# EAGLE design VA-Meter_Analog_Part (EAGLE 7.1.0)
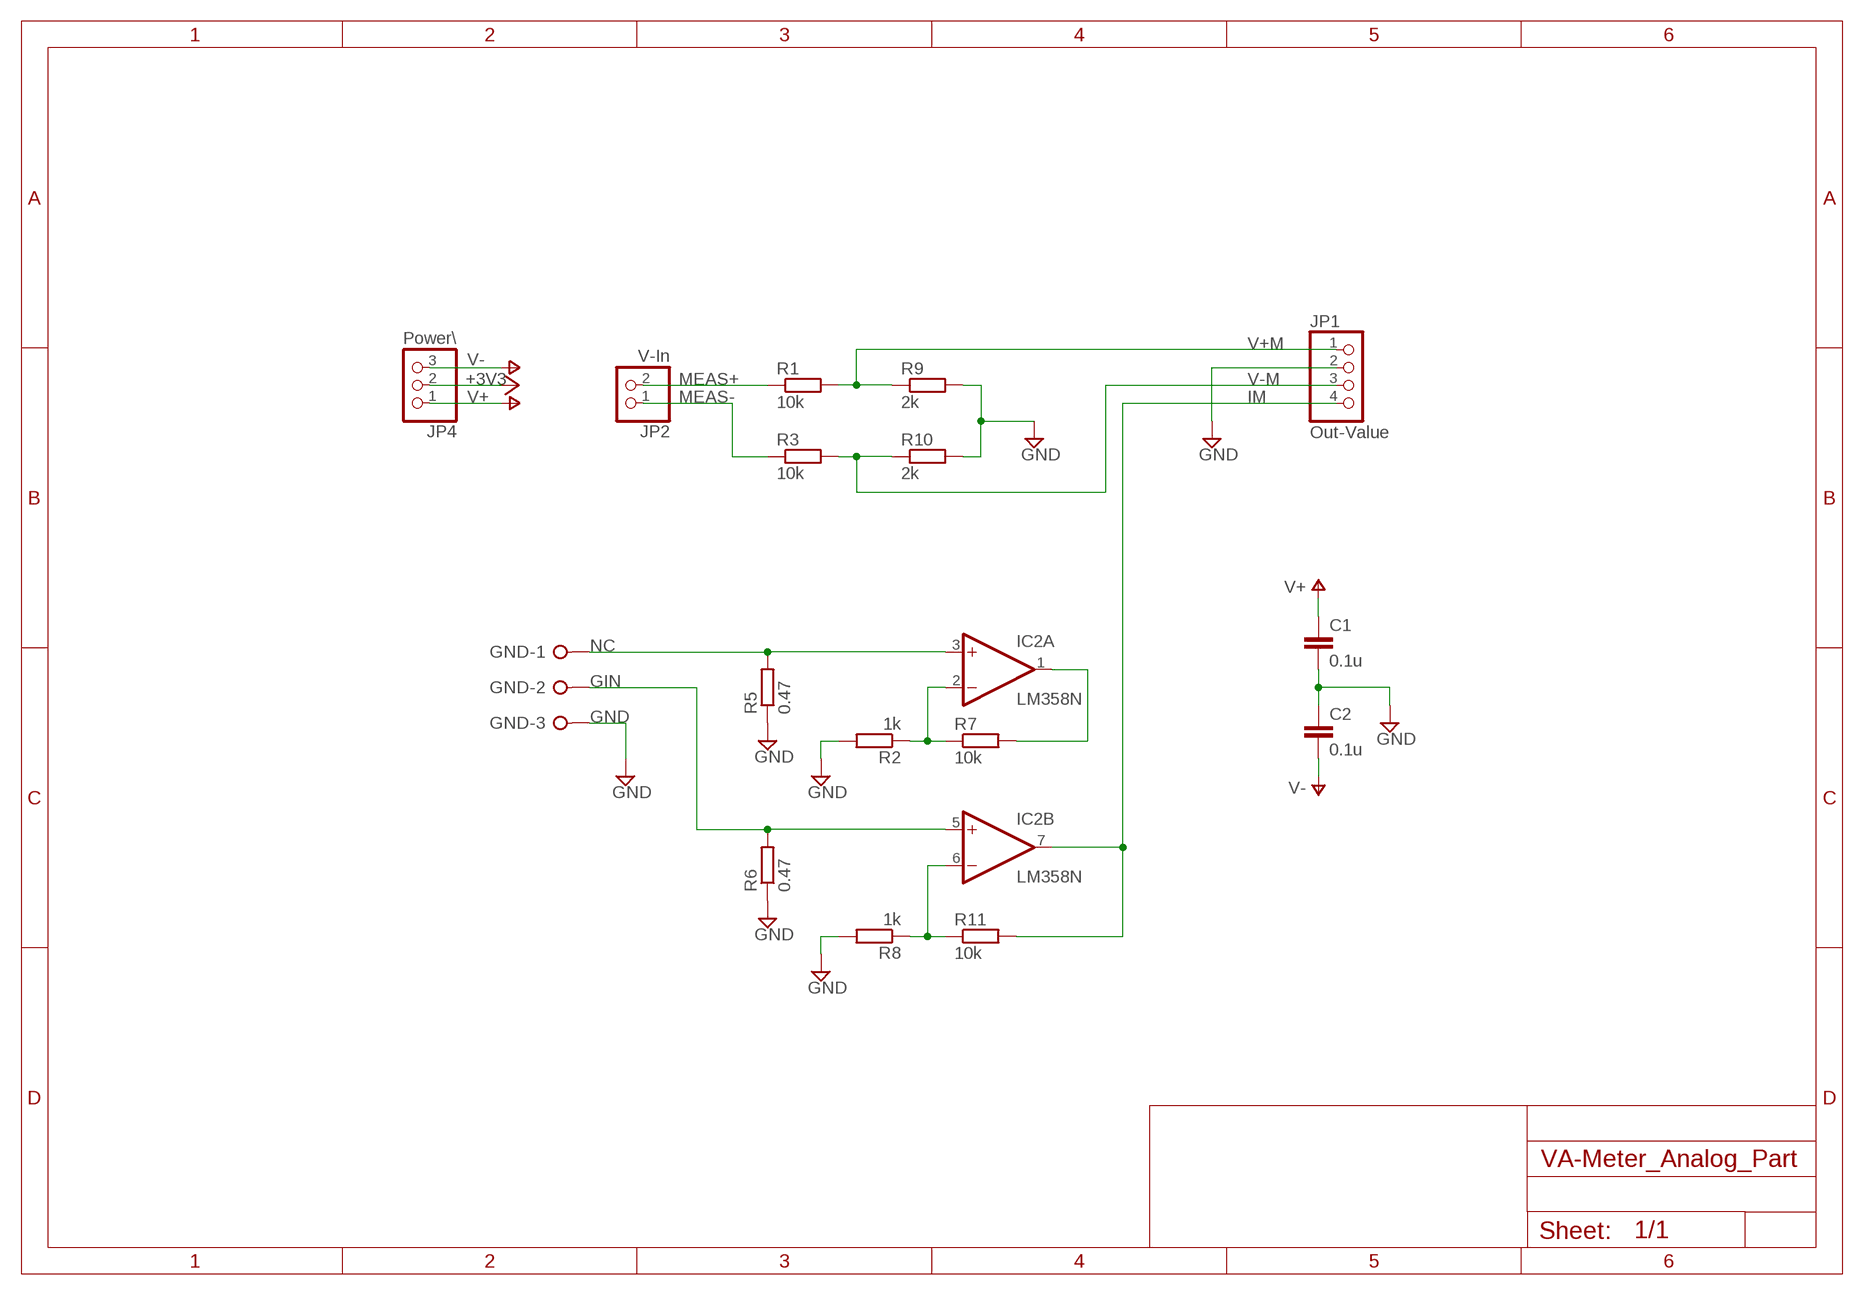
[diagram p0: schematic, sheet 1]

## Parts
C1  0.1u  C-EU050-024X044  [C050-024X044]
C2  0.1u  C-EU050-024X044  [C050-024X044]
GND  W237-03P  [W237-133]
IC2  LM358N  [DIL08]
JP1  Out-Value  PINHD-1X4  [1X04]
JP2  V-In  PINHD-1X2  [1X02]
JP4  Power\  PINHD-1X3  [1X03]
R1  10k  R-EU_0207/7  [0207/7]
R2  1k  R-EU_0207/7  [0207/7]
R3  10k  R-EU_0207/7  [0207/7]
R5  0.47  R-EU_0613/15  [P0613/15]
R6  0.47  R-EU_0613/15  [P0613/15]
R7  10k  R-EU_0207/7  [0207/7]
R8  1k  R-EU_0207/7  [0207/7]
R9  2k  R-EU_0207/7  [0207/7]
R10  2k  R-EU_0207/7  [0207/7]
R11  10k  R-EU_0207/7  [0207/7]

## Nets
+3V3: JP4.2
GIN: GND.2 IC2.5(B:+IN) R6.2
GND: C1.2 C2.1 GND.3 JP1.2 R2.2 R5.1 R6.1 R8.2 R9.2 R10.2
IM: IC2.7(B:OUT) JP1.4 R11.2
MEAS+: JP2.2 R1.1
MEAS-: JP2.1 R3.1
N$1: IC2.1(A:OUT) R7.2
N$6: IC2.2(A:-IN) R2.1 R7.1
N$8: IC2.6(B:-IN) R8.1 R11.1
NC: GND.1 IC2.3(A:+IN) R5.2
V+: C1.1 JP4.1
V+M: JP1.1 R1.2 R9.1
V-: C2.2 JP4.3
V-M: JP1.3 R3.2 R10.1

## Power pins joined to a net without a drawn wire
V+: IC2.8(P:V+)
V-: IC2.4(P:V-)

## Library data of the parts
C1 C2 = rcl:C-EU: CAPACITOR, European symbol
GND = con-wago-508:W237-03P: WAGO SREW CLAMP; OC_FARNELL: unknown; OC_NEWARK: unknown
IC2 = linear:LM358: OP AMP also LM158; LM258; LM2904 Source: http://cache.national.com/ds/LM/LM158.pdf
JP1 = pinhead:PINHD-1X4: PIN HEADER
JP2 = pinhead:PINHD-1X2: PIN HEADER
JP4 = pinhead:PINHD-1X3: PIN HEADER
R1-R3 R5-R11 = rcl:R-EU_: RESISTOR, European symbol

## Board
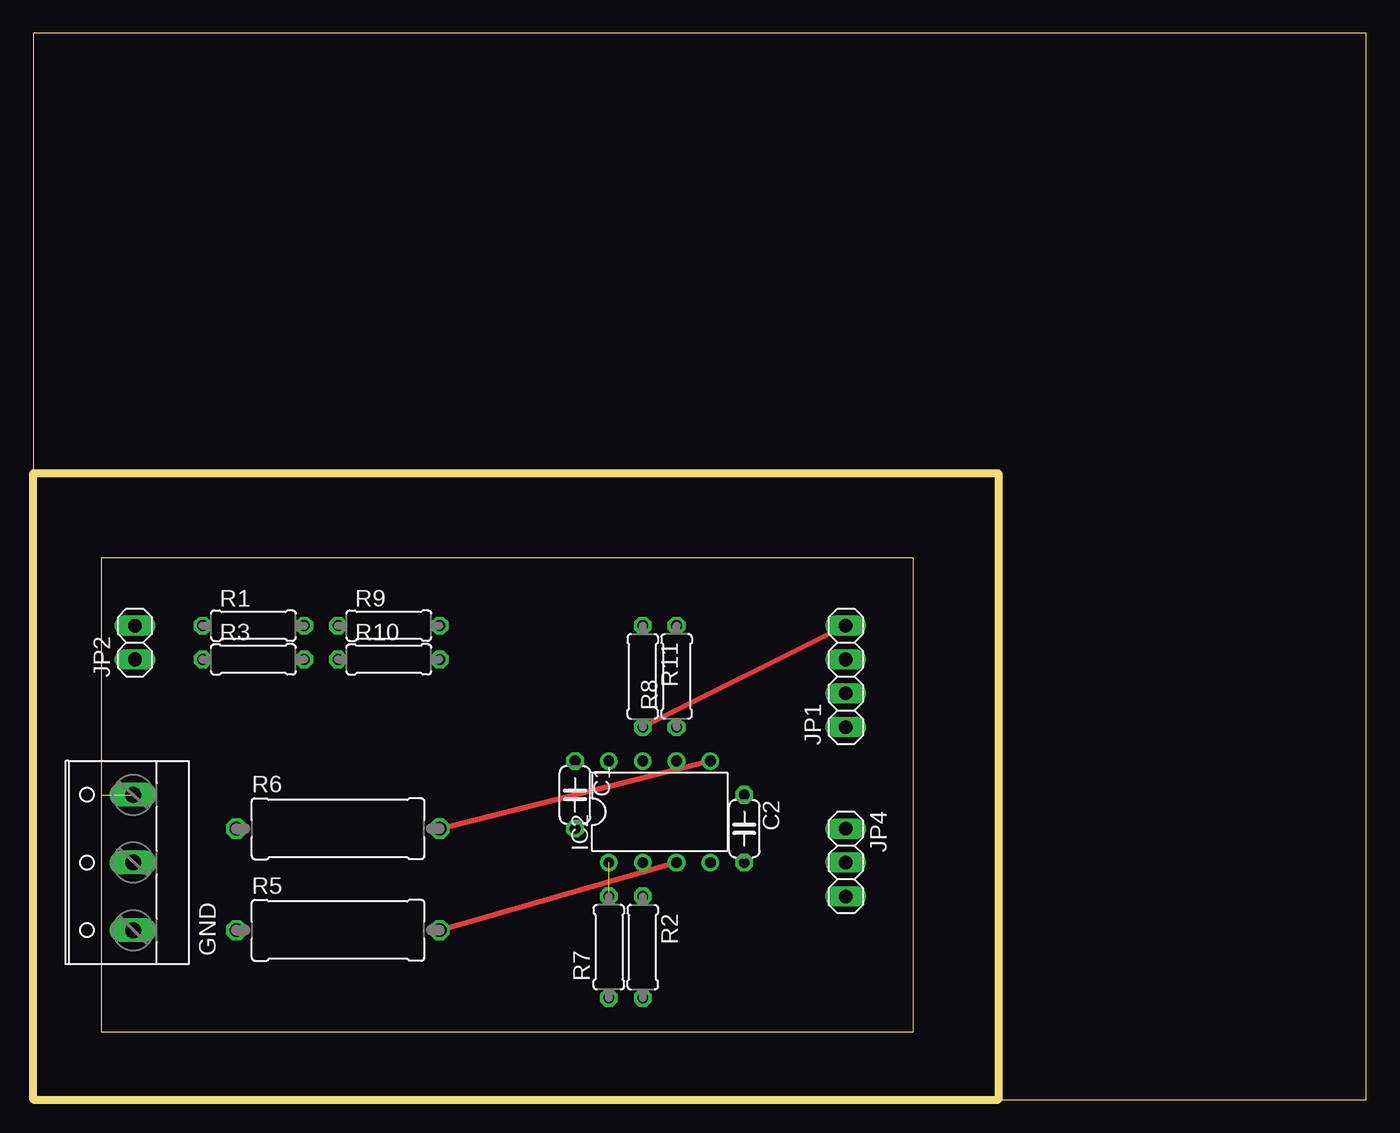
[diagram p1: board, top side]
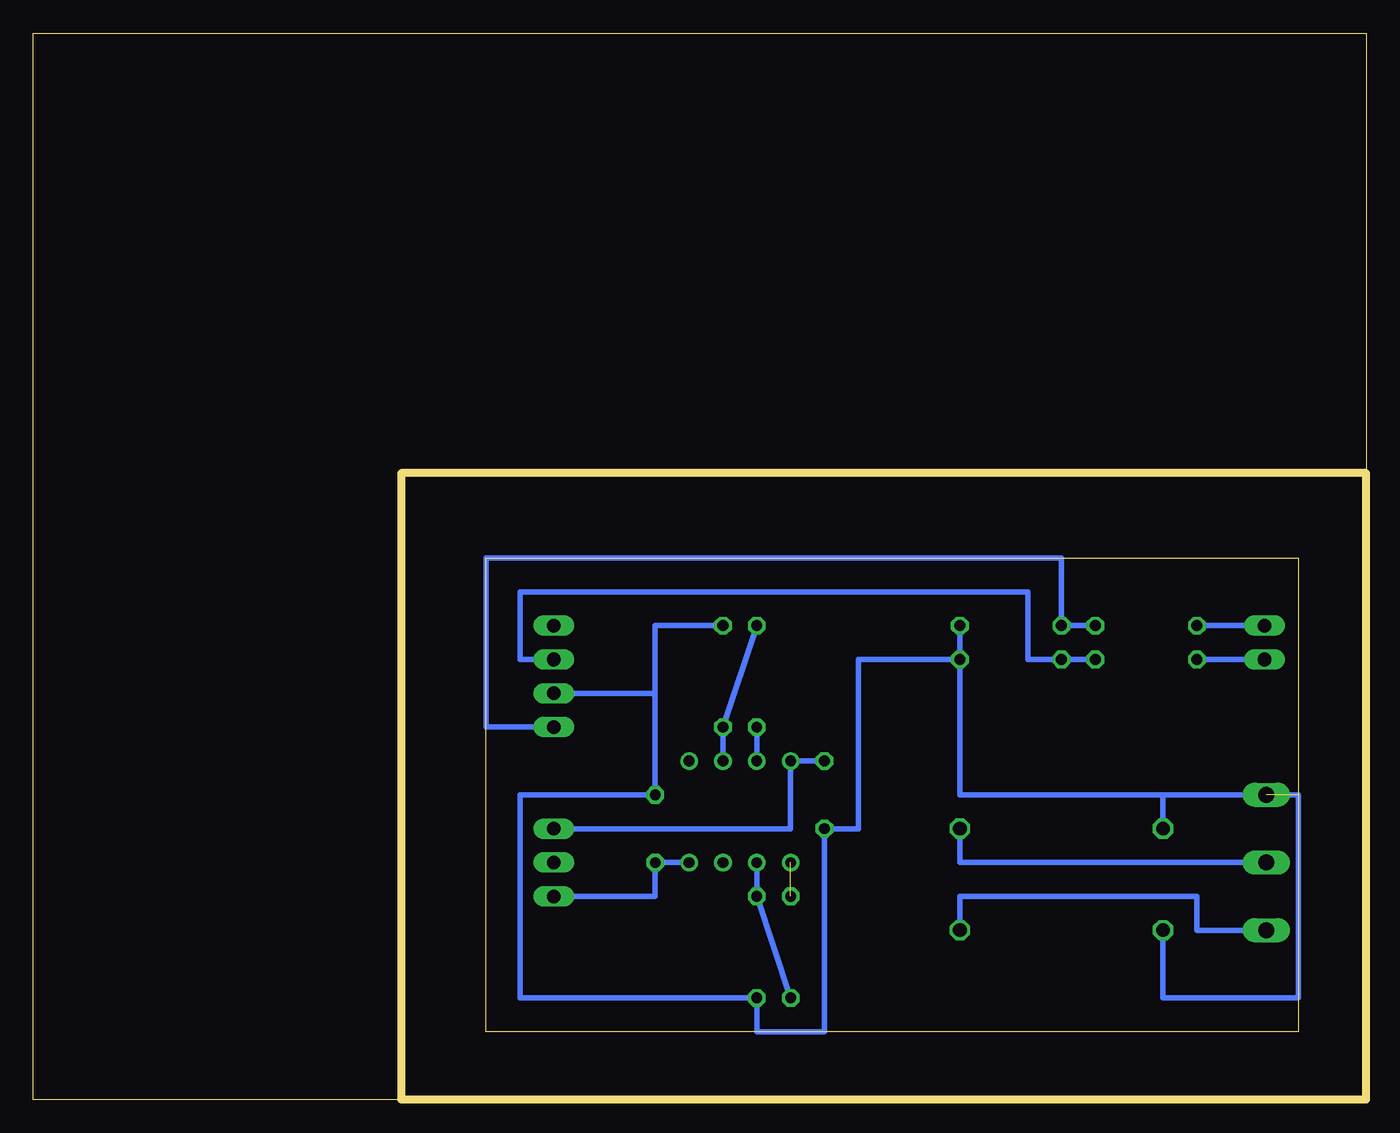
[diagram p2: board, bottom side, seen from below]

Size 100 x 80 mm. Coordinates in mm from the lower left corner, seen from the top.
Outline: 0,0 100,0 100,80 0,80 0,0
Outline: 0,0 0,46.99 72.39,46.99 72.39,0 0,0
Outline: 5.08,5.08 66.04,5.08 66.04,40.64 5.08,40.64 5.08,5.08
Copper layers (1*16): Top 0.035mm / dielectric 1.5mm / Bottom 0.035mm
Design rules "default": minimum track width 10mil, minimum drill 24mil, track to track 8mil, track to pad 8mil, pad to pad 8mil, via to via 8mil, smd to smd 8mil, copper to edge 40mil, drill to drill 8mil, minimum pad ring 10mil, minimum via ring 8mil, stop-mask expansion 4mil, vias tented up to drill 0mil, thermal gap 10mil

### Footprints (pad centres in the part's own frame; a part is rotated, then mirrored left to right if it is on the bottom)
C050-024X044 = drill 0.813 octagon: 1 -2.54,0; 2 2.54,0
W237-133 = drill 1.194 long: 1 -5.08,-0.635; 2 0,-0.635; 3 5.08,-0.635
DIL08 = drill 0.813 pad 1.27: 1 -3.81,-3.81; 2 -1.27,-3.81; 3 1.27,-3.81; 4 3.81,-3.81; 5 3.81,3.81; 6 1.27,3.81; 7 -1.27,3.81; 8 -3.81,3.81
1X04 = drill 1.016 long: 1 -3.81,0; 2 -1.27,0; 3 1.27,0; 4 3.81,0
1X02 = drill 1.016 long: 1 -1.27,0; 2 1.27,0
1X03 = drill 1.016 long: 1 -2.54,0; 2 0,0; 3 2.54,0
0207/7 = drill 0.813 octagon: 1 -3.81,0; 2 3.81,0
P0613/15 = drill 1.016 octagon: 1 -7.62,0; 2 7.62,0

### Placement (x,y rotation side)
C1  40.64,22.86 270 top
C2  53.34,20.32 270 top
GND  6.86,17.78 90 top
IC2  46.99,21.59 0 top
JP1  60.96,31.75 90 top
JP2  7.62,34.29 90 top
JP4  60.96,17.78 270 top
R1  16.51,35.56 0 top
R2  45.72,11.43 270 top
R3  16.51,33.02 0 top
R5  22.86,12.7 0 top
R6  22.86,20.32 0 top
R7  43.18,11.43 90 top
R8  48.26,31.75 90 top
R9  26.67,35.56 0 top
R10  26.67,33.02 0 top
R11  45.72,31.75 270 top

### Tracks (layer width: path | path; a pad name or v marks a point on that pad's centre or on a via)
GIN
  Top 0.406: R6.2 IC2.5
  Bottom 0.406: GND.2 30.48,17.78 R6.2
GND  (1 unrouted)
  Bottom 0.406: R8.2 53.34,35.56 53.34,30.48 | 53.34,30.48 C2.1 63.5,22.86 63.5,7.62 R2.2 45.72,5.08 40.64,5.08 C1.2 38.1,20.32 38.1,33.02 R10.2 | R9.2 R10.2 | R6.1 15.24,22.86 | 15.24,22.86 5.08,22.86 5.08,7.62 15.24,7.62 R5.1 | R10.2 30.48,22.86 15.24,22.86 | JP1.2 53.34,30.48
IM
  Top 0.406: R11.2 JP1.4
  Bottom 0.406: IC2.7 R11.2
MEAS+
  Bottom 0.406: JP2.2 R1.1
MEAS-
  Bottom 0.406: JP2.1 R3.1
N$1  (1 unrouted)
N$6
  Bottom 0.406: IC2.2 R2.1 R7.1
N$8
  Bottom 0.406: IC2.6 R8.1 R11.1
NC
  Top 0.406: IC2.3 R5.2
  Bottom 0.406: GND.1 12.7,12.7 12.7,15.24 30.48,15.24 R5.2
V+
  Bottom 0.406: C1.1 IC2.8 43.18,20.32 JP4.1
V+M
  Bottom 0.406: R1.2 R9.1 22.86,40.64 66.04,40.64 66.04,27.94 JP1.1
V-
  Bottom 0.406: IC2.4 C2.2 53.34,15.24 JP4.3
V-M
  Bottom 0.406: R3.2 R10.1 25.4,33.02 25.4,38.1 63.5,38.1 63.5,33.02 JP1.3